# EAGLE design USBSocket_Type8_v1.0 (EAGLE 9.6.2)
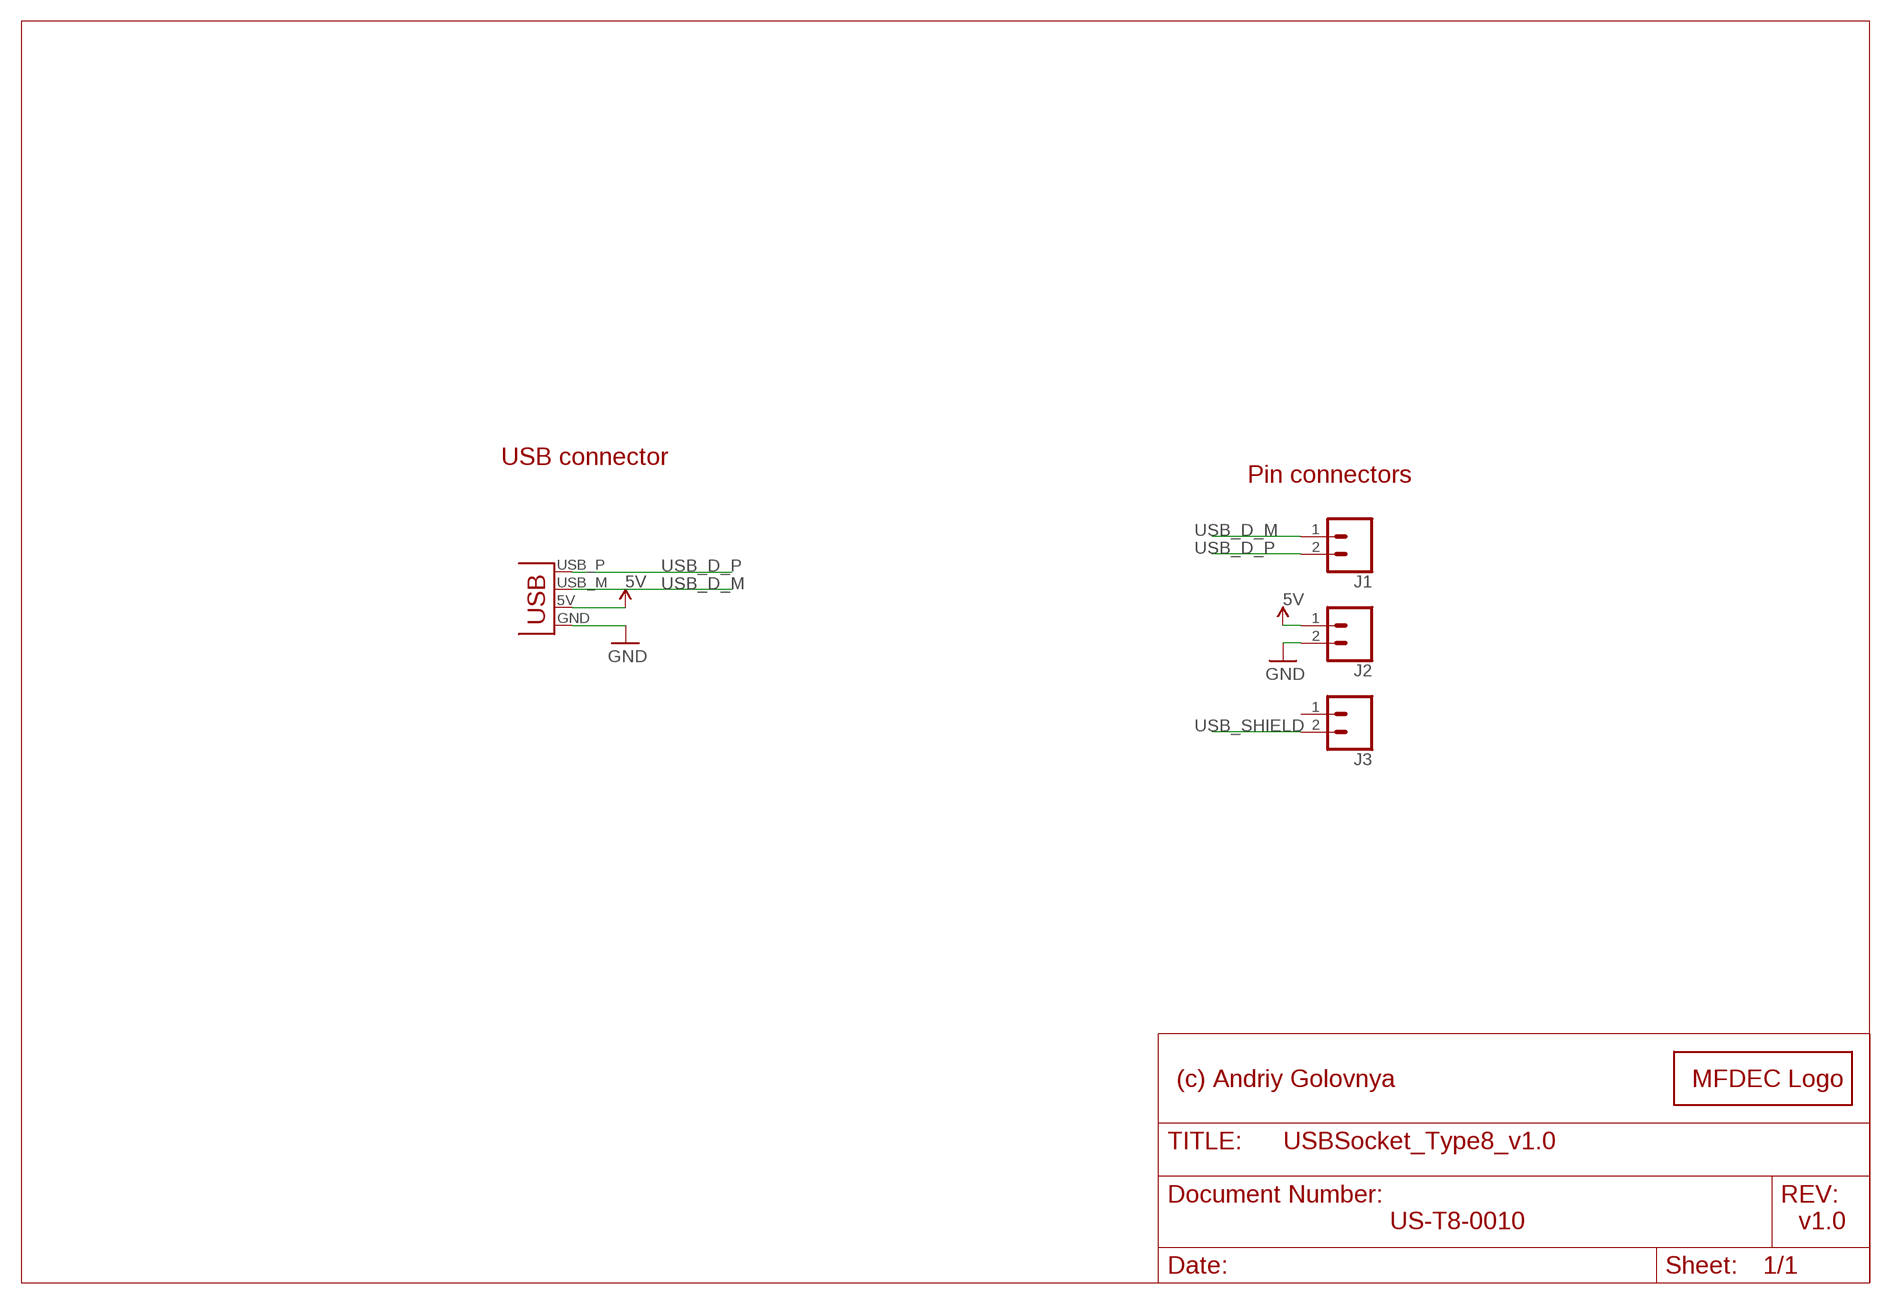
[diagram p0: schematic, sheet 1]

## Parts
J1  CONN_02  [1X02]
J2  CONN_02  [1X02]
J3  CONN_02  [1X02]
LOGO1  MFDECLOGO_L_10MM  [MFDEC_L_10MM]
X1  USBPCB  [USB-A-PCB]

## Nets
5V [POWER]: J2.1 X1.5V(VBUS)
GND [POWER]: J2.2 X1.GND
USB_D_M [XUSB]: J1.1 X1.USB_M(D-)
USB_D_P [XUSB]: J1.2 X1.USB_P(D+)
USB_SHIELD: J3.2
Unconnected: J3.1

## Notes on the sheet
- USB connector
- Pin connectors
- (c) Andriy Golovnya
- US-T8-0010 | v1.0

## Library data of the parts
J1-J3 = SparkFun-Connectors:CONN_02: Multi connection point. Often used as Generic Header-pin footprint for 0.1 inch spaced/style header connections On any of the 0.1 inch spaced packages, you can populate with these: Break Away Headers - Straight <https://www.sparkfun.com/products/116> (PRT-00116) Break Away Male Headers - Right Angle <https://www.sparkfun.com/products/553> (PRT-00553) Female Headers <https://www.sparkfun.com/products/115> (PRT-00115) Break Away Headers - Machine Pin <https://www.sparkfun.com/products/117> (PRT-00117) Break Away Female Headers - Swiss Machine Pin <https://www.sparkfun.com/products/743> (PRT-00743) For SCREWTERMINALS and SPRING TERMINALS visit here: Screw Terimnals on SparkFun.com <https://www.sparkfun.com/search/results?term=Screw+Terminals> (5mm/3.5mm/2.54mm spacing) This device is also useful as a general connection point to wire up your design to another part of your project. Our various solder wires solder well into these plated through hole pads. Hook-Up Wire - Assortment (Stranded, 22 AWG) <https://www.sparkfun.com/products/11375> (PRT-11375) Hook-Up Wire - Assortment (Solid Core, 22 AWG) <https://www.sparkfun.com/products/11367> (PRT-11367) View the entire wire category on our website here <https://www.sparkfun.com/categories/141> Special notes: Molex polarized connector foot print use with: PRT-08233 with associated crimp pins and housings. 2.54_SCREWTERM for use with PRT-10571. 3.5mm Screw Terminal footprints for PRT-08084 5mm Screw Terminal footprints for use with PRT-08432
LOGO1 = _my_logos:MFDECLOGO: Midnight Fog - Digital Eye Candy LOGO
X1 = SparkFun:USB: USB Connectors USB-B-PTH is fully proven SKU : PRT-00139 USB-miniB is fully proven SKU : PRT-00587 USB-A-PCB is untested. USB-A-H is throughly reviewed, but untested. Spark Fun Electronics SKU : PRT-00437 USB-B-SMT is throughly reviewed, but untested. Needs silkscreen touching up. USB-A-S has not been used/tested USB-MB-H has not been used/tested

## Net classes
1 XUSB: width 0.305 mm
2 USB: width 0.305 mm
3 POWER: width 0.305 mm

## Board
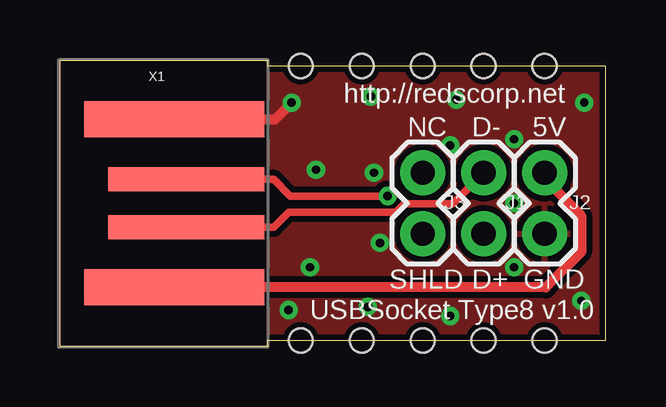
[diagram p1: board, top side]
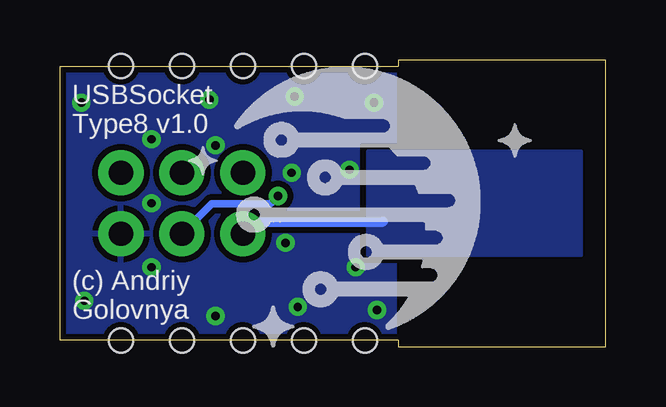
[diagram p2: board, bottom side, seen from below]

Size 22.73 x 11.94 mm. Coordinates in mm from the lower left corner, seen from the top.
Outline: 8.64,0.25 22.73,0.25 22.73,11.68 8.64,11.68 8.64,11.94 0,11.94 0,0 8.64,0 8.64,0.25
Copper layers (1*16): Top 0.035mm / dielectric 1.5mm / Bottom 0.035mm
Design rules "default *": minimum track width 6mil, minimum drill 0.35mm, track to track 6mil, track to pad 6mil, pad to pad 6mil, via to via 6mil, smd to smd 6mil, copper to edge 10mil, drill to drill 6mil, minimum pad ring 10mil, minimum via ring 8mil, stop-mask expansion 4mil, vias tented up to drill 20mil, thermal gap 10mil
Holes 1 mm at 20.19,0.25 17.65,0.25 15.11,0.25 12.57,0.25 10.03,0.25 10.03,11.68 12.57,11.68 15.11,11.68 17.65,11.68 20.19,11.68

### Footprints (pad centres in the part's own frame; a part is rotated, then mirrored left to right if it is on the bottom)
1X02 = drill 1.016 pad 1.88: 1 0,0; 2 2.54,0
USB-A-PCB = smd 7.5 x 1.5: 5V -0.2,-3.5; GND -0.2,3.5 | smd 6.5 x 1: USB_M 0.3,-1; USB_P 0.3,1

### Placement (x,y rotation side)
J1  17.65,7.24 270 top
J2  20.19,7.24 270 top
J3  15.11,7.24 270 top
LOGO1  2.29,12.57 180 bottom
X1  4.95,5.97 0 top

### Tracks (layer width: path | path; a pad name or v marks a point on that pad's centre or on a via)
5V
  Top 0.406: J2.1 20.19,6.98 21.72,5.46 21.72,3.94 20.25,2.47 X1.5V
GND  (via drill 0.35)
  Top 0.406: X1.GND 8.96,9.47 v9.65,10.16
  other vias: 16.26,8.38 21.72,1.91 21.84,10.16 16.26,1.27 16.51,10.29 10.41,3.3 13.08,7.24 18.92,3.3 18.92,5.97 12.83,1.65 18.92,8.64 9.53,1.52 13.34,4.32 12.95,10.41 10.67,7.37
  pour Top (isolate 0.254, rank 2): 8.76,0.25 28.83,0.25 28.83,11.68 8.76,11.68
  pour Bottom (isolate 0.254, rank 2): 8.76,0.25 25.53,0.25 25.53,11.68 8.76,11.68
USB_D_M
  Top 0.305: X1.USB_M 8.91,4.97 9.53,5.59 13.99,5.59 14.34,5.94 16.36,5.94 J1.1
USB_D_P  (via drill 0.35)
  Top 0.305: X1.USB_P 8.91,6.97 9.6,6.27 v13.65,6.27
  Bottom 0.305: v13.65,6.27 13.98,5.94 16.41,5.94 J1.2
USB_SHIELD
  Bottom 0.406: J3.2 14.61,5.21 9.27,5.21
  pour Bottom: 1.02,3.81 9.91,3.81 9.91,8.13 1.02,8.13

### Text on the board
tPlace: http://redscorp.net | NC | D- | 5V | SHLD | D+ | GND | USBSocket Type8 v1.0
bPlace: USBSocket / Type8 v1.0 | (c) Andriy / Golovnya